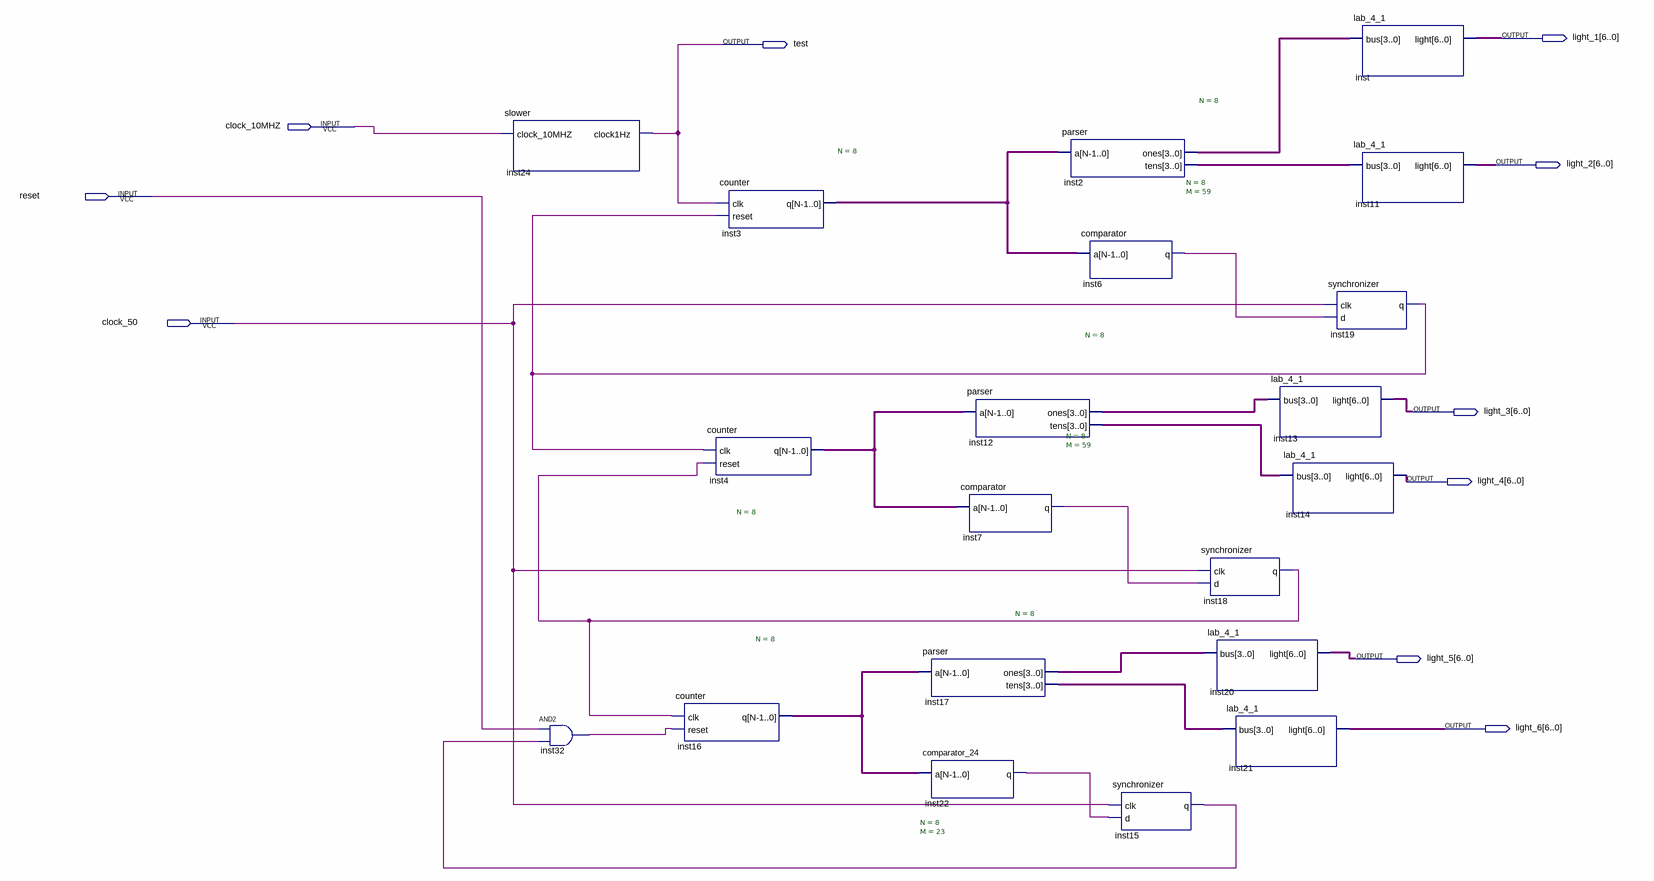
[diagram p0: schematic sheet]
// Quartus schematic final_project_2 - Copy.bdf as structural Verilog: 20 symbols, 10 pins
module \final_project_2_-_Copy  (
  input  clock_10MHZ,
  input  reset,
  input  clock_50,
  output [6:0] light_1,
  output test,
  output [6:0] light_2,
  output [6:0] light_3,
  output [6:0] light_4,
  output [6:0] light_5,
  output [6:0] light_6
);

  wire inst6_q, inst7_q, inst15_q, inst18_q, inst19_q, inst22_q, inst32_out;
  wire [3:0] inst2_ones, inst2_tens, inst12_ones, inst12_tens, inst17_ones, inst17_tens;
  wire [7:0] inst3_q, inst4_q, inst16_q;

  slower inst24 (.clock_10MHZ(clock_10MHZ), .clock1Hz(test));
  and inst32 (inst32_out, reset, inst15_q);
  counter #(.N(8)) inst16 (.clk(inst18_q), .reset(inst32_out), .q(inst16_q));
  counter #(.N(8)) inst3 (.clk(test), .reset(inst19_q), .q(inst3_q));
  counter #(.N(8)) inst4 (.clk(inst19_q), .reset(inst18_q), .q(inst4_q));
  parser #(.N(8)) inst17 (.a(inst16_q), .ones(inst17_ones), .tens(inst17_tens));
  comparator_24 #(.N(8), .M(23)) inst22 (.a(inst16_q), .q(inst22_q));
  parser #(.N(8)) inst12 (.a(inst4_q), .ones(inst12_ones), .tens(inst12_tens));
  comparator #(.N(8), .M(59)) inst7 (.a(inst4_q), .q(inst7_q));
  parser #(.N(8)) inst2 (.a(inst3_q), .ones(inst2_ones), .tens(inst2_tens));
  comparator #(.N(8), .M(59)) inst6 (.a(inst3_q), .q(inst6_q));
  synchronizer inst15 (.clk(clock_50), .d(inst22_q), .q(inst15_q));
  synchronizer inst18 (.clk(clock_50), .d(inst7_q), .q(inst18_q));
  lab_4_1 inst20 (.bus(inst17_ones), .light(light_5));
  lab_4_1 inst21 (.bus(inst17_tens), .light(light_6));
  lab_4_1 inst13 (.bus(inst12_ones), .light(light_3));
  lab_4_1 inst14 (.bus(inst12_tens), .light(light_4));
  lab_4_1 inst (.bus(inst2_ones), .light(light_1));
  lab_4_1 inst11 (.bus(inst2_tens), .light(light_2));
  synchronizer inst19 (.clk(clock_50), .d(inst6_q), .q(inst19_q));
endmodule
